# Altium project motordriver-v5.2.PrjPcb (part 2 of 3)

## Sheet ui-jetson-nano.SchDoc
size 420 x 297 mm; SheetNumber: 3; SheetTotal: 13
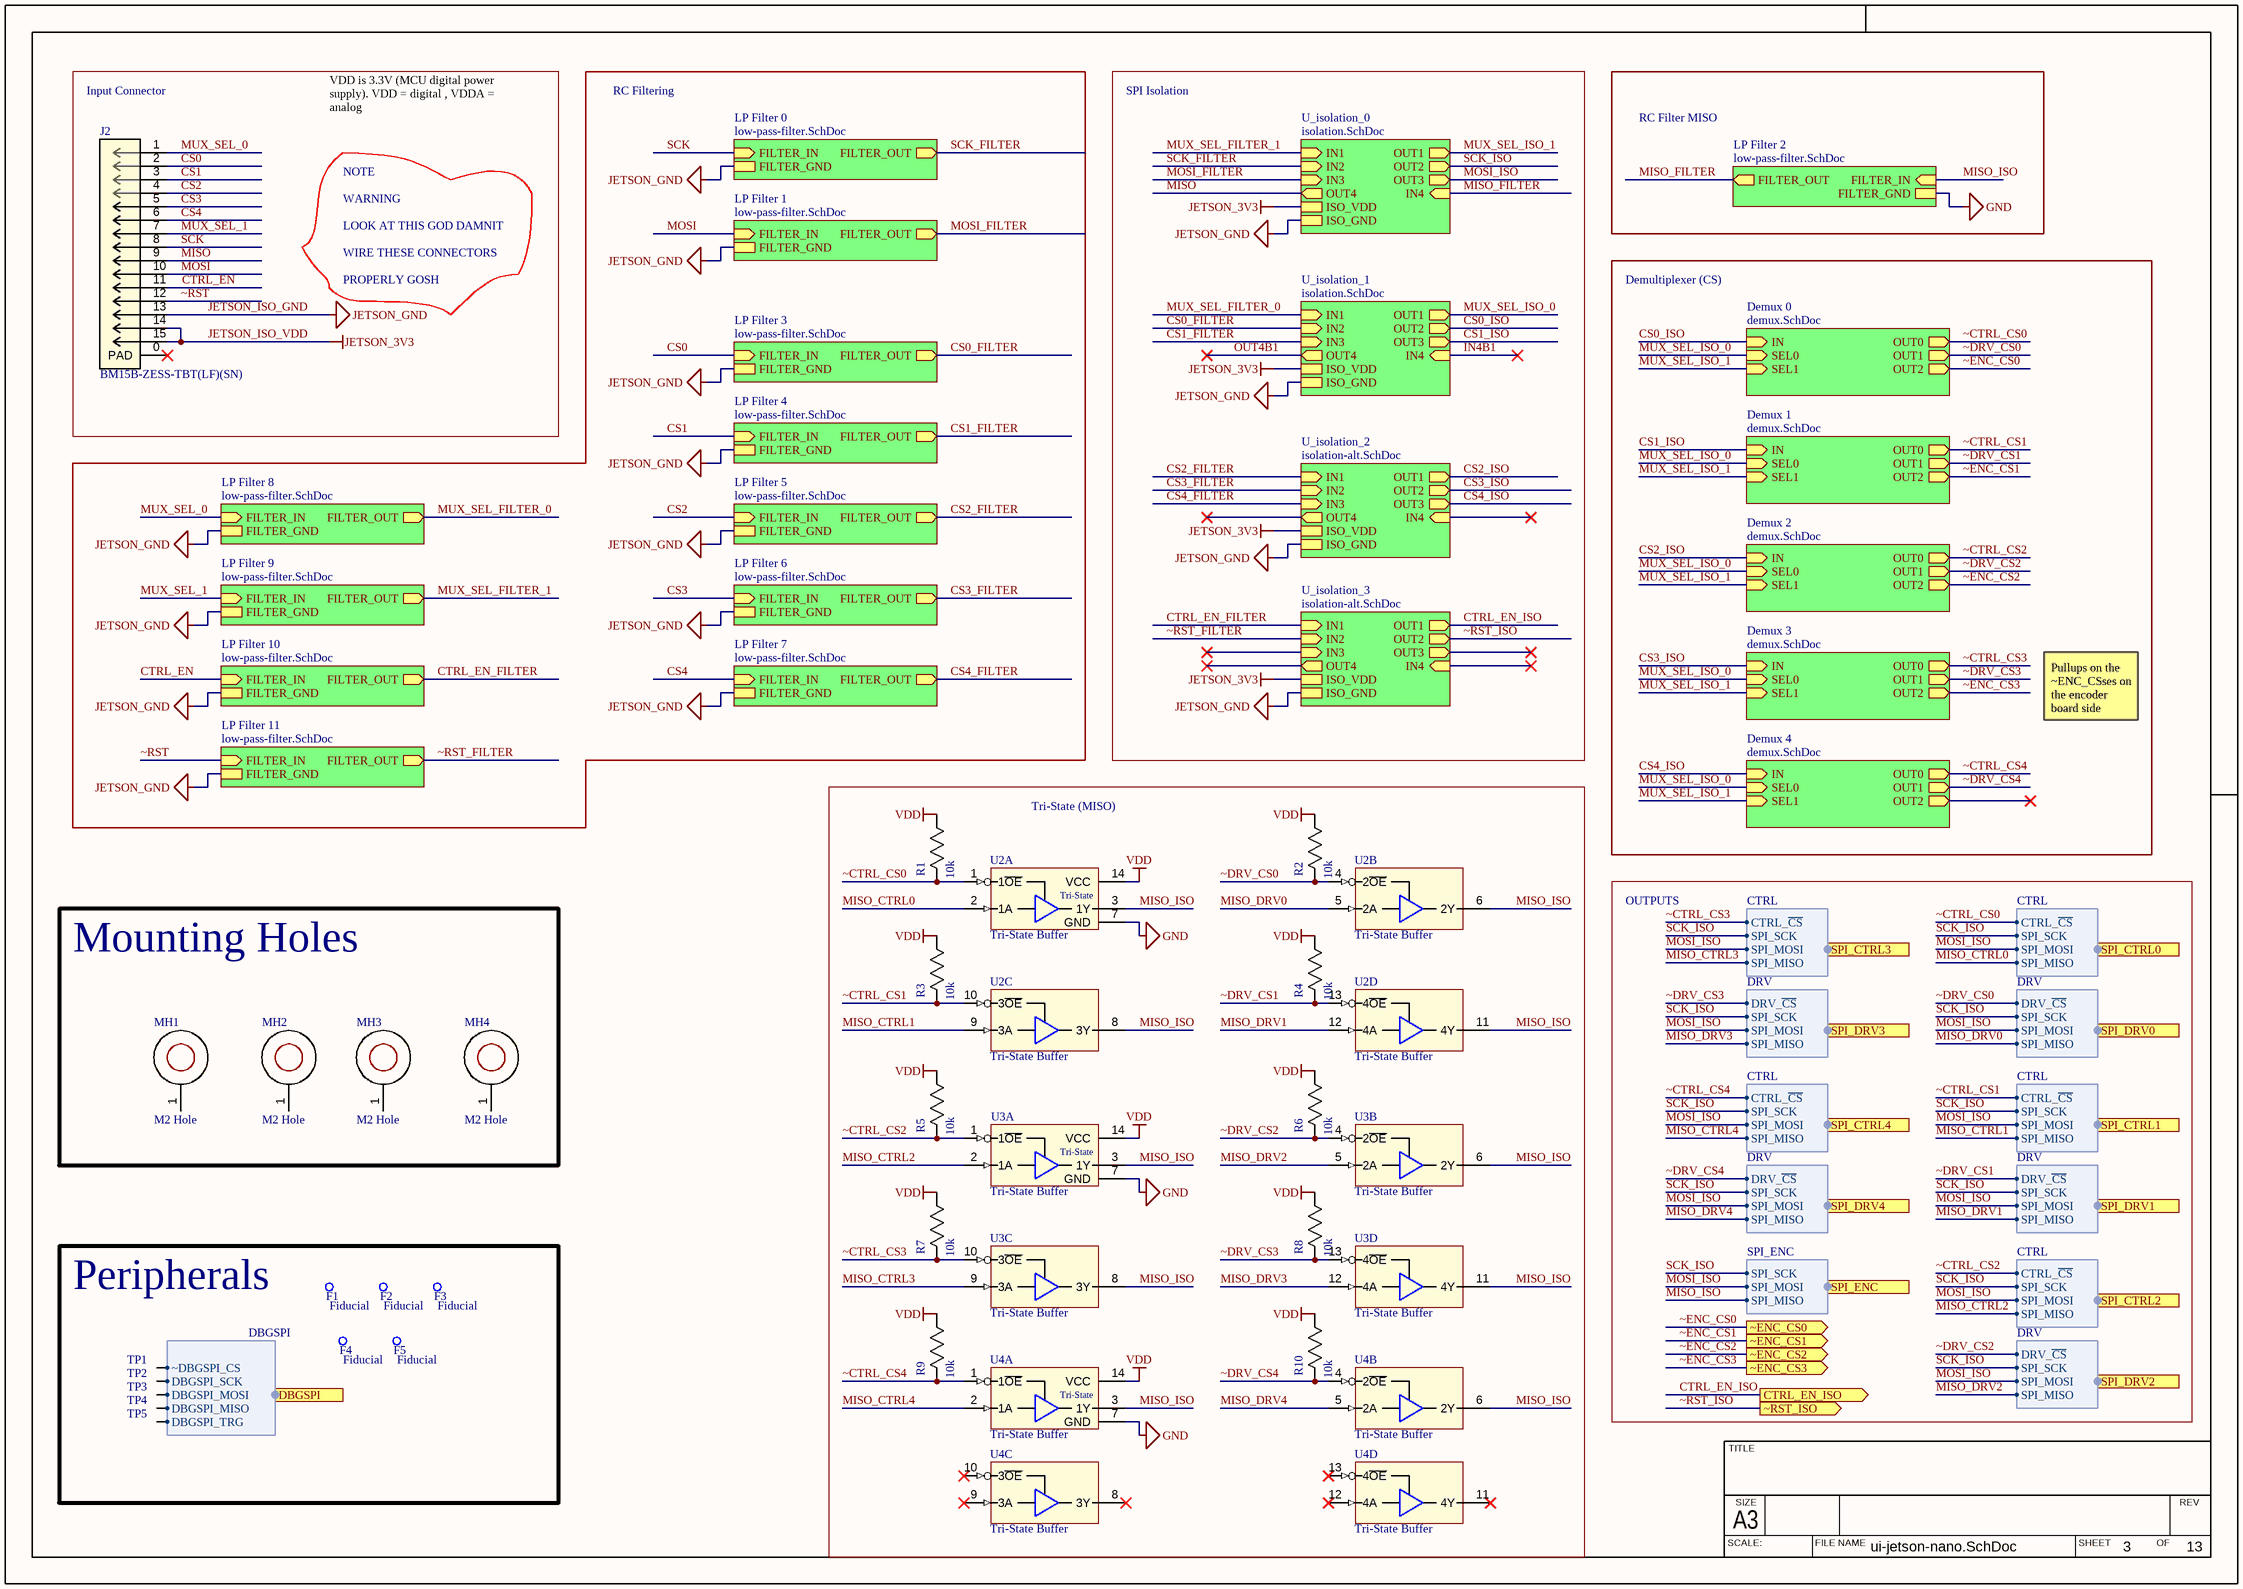
[diagram p6: ui-jetson-nano.SchDoc]

### Parts
F1  Fiducial  [Fiducial]  (no BOM)
F2  Fiducial  [Fiducial]  (no BOM)
F3  Fiducial  [Fiducial]  (no BOM)
F4  Fiducial  [Fiducial]  (no BOM)
F5  Fiducial  [Fiducial]  (no BOM)
J2  BM15B-ZESS-TBT(LF)(SN)  [JST ZE SMT 15POS]
MH1  M2 Hole  [Mounting Hole M2]  (no BOM)
MH2  M2 Hole  [Mounting Hole M2]  (no BOM)
MH3  M2 Hole  [Mounting Hole M2]  (no BOM)
MH4  M2 Hole  [Mounting Hole M2]  (no BOM)
R1  10k  [0603]
R2  10k  [0603]
R3  10k  [0603]
R4  10k  [0603]
R5  10k  [0603]
R6  10k  [0603]
R7  10k  [0603]
R8  10k  [0603]
R9  10k  [0603]
R10  10k  [0603]
TP1  DBG_CS  [TP]  (value not drawn)  (no BOM)
TP2  DBG_SCK  [TP]  (value not drawn)  (no BOM)
TP3  DBG_MOSI  [TP]  (value not drawn)  (no BOM)
TP4  DBG_MISO  [TP]  (value not drawn)  (no BOM)
TP5  DBG_TRG  [TP]  (value not drawn)  (no BOM)
U2  Tri-State Buffer  [14-TSSOP]  (parts A,B,C,D of 4)
U3  Tri-State Buffer  [14-TSSOP]  (parts A,B,C,D of 4)
U4  Tri-State Buffer  [14-TSSOP]  (parts A,B,C,D of 4)

### Blocks framed on the sheet
Tri-State (MISO): R1-R10 U2-U4
Mounting Holes: MH1-MH4
Peripherals: F1-F5 TP1-TP5

### Sub-sheets
Demux 0 = demux.SchDoc: IN (in), SEL0 (in), SEL1 (in), OUT1 (out), OUT2 (out), OUT0 (out)
Demux 1 = demux.SchDoc: IN (in), SEL0 (in), SEL1 (in), OUT1 (out), OUT2 (out), OUT0 (out)
Demux 2 = demux.SchDoc: IN (in), SEL0 (in), SEL1 (in), OUT1 (out), OUT2 (out), OUT0 (out)
Demux 3 = demux.SchDoc: IN (in), SEL0 (in), SEL1 (in), OUT1 (out), OUT2 (out), OUT0 (out)
Demux 4 = demux.SchDoc: IN (in), SEL0 (in), SEL1 (in), OUT1 (out), OUT2 (out), OUT0 (out)
LP Filter 0 = low-pass-filter.SchDoc: FILTER_OUT (out), FILTER_IN (in), FILTER_GND
LP Filter 1 = low-pass-filter.SchDoc: FILTER_OUT (out), FILTER_IN (in), FILTER_GND
LP Filter 2 = low-pass-filter.SchDoc: FILTER_OUT (out), FILTER_IN (in), FILTER_GND
LP Filter 3 = low-pass-filter.SchDoc: FILTER_OUT (out), FILTER_IN (in), FILTER_GND
LP Filter 4 = low-pass-filter.SchDoc: FILTER_OUT (out), FILTER_IN (in), FILTER_GND
LP Filter 5 = low-pass-filter.SchDoc: FILTER_OUT (out), FILTER_IN (in), FILTER_GND
LP Filter 6 = low-pass-filter.SchDoc: FILTER_OUT (out), FILTER_IN (in), FILTER_GND
LP Filter 7 = low-pass-filter.SchDoc: FILTER_OUT (out), FILTER_IN (in), FILTER_GND
LP Filter 8 = low-pass-filter.SchDoc: FILTER_OUT (out), FILTER_IN (in), FILTER_GND
LP Filter 9 = low-pass-filter.SchDoc: FILTER_OUT (out), FILTER_IN (in), FILTER_GND
LP Filter 10 = low-pass-filter.SchDoc: FILTER_OUT (out), FILTER_IN (in), FILTER_GND
LP Filter 11 = low-pass-filter.SchDoc: FILTER_OUT (out), FILTER_IN (in), FILTER_GND
U_isolation_0 = isolation.SchDoc: OUT1 (out), IN1 (in), IN2 (in), IN3 (in), OUT4 (out), OUT3 (out), OUT2 (out), IN4 (in), ISO_VDD, ISO_GND
U_isolation_1 = isolation.SchDoc: OUT1 (out), IN1 (in), IN2 (in), IN3 (in), OUT4 (out), OUT3 (out), OUT2 (out), IN4 (in), ISO_VDD, ISO_GND
U_isolation_2 = isolation-alt.SchDoc: OUT1 (out), IN1 (in), IN2 (in), IN3 (in), OUT4 (out), OUT3 (out), OUT2 (out), IN4 (in), ISO_VDD, ISO_GND
U_isolation_3 = isolation-alt.SchDoc: OUT1 (out), IN1 (in), IN2 (in), IN3 (in), OUT4 (out), OUT3 (out), OUT2 (out), IN4 (in), ISO_VDD, ISO_GND

### Ports
CTRL_EN_ISO (out), DBGSPI (harness DBGSPI), SPI_CTRL0 (harness CTRL), SPI_CTRL1 (harness CTRL), SPI_CTRL2 (harness CTRL), SPI_CTRL3 (harness CTRL), SPI_CTRL4 (harness CTRL), SPI_DRV0 (harness DRV), SPI_DRV1 (harness DRV), SPI_DRV2 (harness DRV), SPI_DRV3 (harness DRV), SPI_DRV4 (harness DRV), SPI_ENC (harness SPI_ENC), ~ENC_CS0 (out), ~ENC_CS1 (out), ~ENC_CS2 (out), ~ENC_CS3 (out), ~RST_ISO (out)

### Harnesses
CTRL: SPI_SCK, SPI_MISO, SPI_MOSI, CTRL_~{CS}
DRV: SPI_SCK, SPI_MISO, SPI_MOSI, DRV_~{CS}
SPI_ENC: SPI_SCK, SPI_MISO, SPI_MOSI
DBGSPI: ~DBGSPI_CS, DBGSPI_SCK, DBGSPI_MOSI, DBGSPI_MISO, DBGSPI_TRG

### Nets
GND: U2.7(GND) U3.7(GND) U4.7(GND) ; sheet LP Filter 2/FILTER_GND
JETSON_3V3: J2.14 J2.15 ; sheet U_isolation_0/ISO_VDD, sheet U_isolation_1/ISO_VDD, sheet U_isolation_2/ISO_VDD, sheet U_isolation_3/ISO_VDD  [also labelled JETSON_ISO_VDD]
JETSON_GND: J2.13 ; sheet LP Filter 0/FILTER_GND, sheet U_isolation_0/ISO_GND, sheet U_isolation_1/ISO_GND, sheet U_isolation_2/ISO_GND, sheet U_isolation_3/ISO_GND, sheet LP Filter 1/FILTER_GND, sheet LP Filter 3/FILTER_GND, sheet LP Filter 4/FILTER_GND, sheet LP Filter 5/FILTER_GND, sheet LP Filter 6/FILTER_GND, sheet LP Filter 7/FILTER_GND, sheet LP Filter 8/FILTER_GND, sheet LP Filter 9/FILTER_GND, sheet LP Filter 10/FILTER_GND, sheet LP Filter 11/FILTER_GND  [also labelled JETSON_ISO_GND]
VDD: R1.1(R1) R2.1(R1) R3.1(R1) R4.1(R1) R5.1(R1) R6.1(R1) R7.1(R1) R8.1(R1) R9.1(R1) R10.1(R1) U2.14(VCC) U3.14(VCC) U4.14(VCC)
CS0: J2.2 ; sheet LP Filter 3/FILTER_IN
CS0_FILTER: sheet U_isolation_1/IN2, sheet LP Filter 3/FILTER_OUT
CS0_ISO: sheet U_isolation_1/OUT2, sheet Demux 0/IN
CS1: J2.3 ; sheet LP Filter 4/FILTER_IN
CS1_FILTER: sheet U_isolation_1/IN3, sheet LP Filter 4/FILTER_OUT
CS1_ISO: sheet U_isolation_1/OUT3, sheet Demux 1/IN
CS2: J2.4 ; sheet LP Filter 5/FILTER_IN
CS2_FILTER: sheet U_isolation_2/IN1, sheet LP Filter 5/FILTER_OUT
CS2_ISO: sheet U_isolation_2/OUT1, sheet Demux 2/IN
CS3: J2.5 ; sheet LP Filter 6/FILTER_IN
CS3_FILTER: sheet U_isolation_2/IN2, sheet LP Filter 6/FILTER_OUT
CS3_ISO: sheet U_isolation_2/OUT2, sheet Demux 3/IN
CS4: J2.6 ; sheet LP Filter 7/FILTER_IN
CS4_FILTER: sheet U_isolation_2/IN3, sheet LP Filter 7/FILTER_OUT
CS4_ISO: sheet U_isolation_2/OUT3, sheet Demux 4/IN
CTRL_EN: J2.11 ; sheet LP Filter 10/FILTER_IN
CTRL_EN_FILTER: sheet U_isolation_3/IN1, sheet LP Filter 10/FILTER_OUT
CTRL_EN_ISO: port CTRL_EN_ISO, sheet U_isolation_3/OUT1
DBGSPI.DBGSPI_MISO: TP4.1 ; port DBGSPI.DBGSPI_MISO
DBGSPI.DBGSPI_MOSI: TP3.1 ; port DBGSPI.DBGSPI_MOSI
DBGSPI.DBGSPI_SCK: TP2.1 ; port DBGSPI.DBGSPI_SCK
DBGSPI.DBGSPI_TRG: TP5.1 ; port DBGSPI.DBGSPI_TRG
DBGSPI.~DBGSPI_CS: TP1.1 ; port DBGSPI.~DBGSPI_CS
MISO: J2.9 ; sheet U_isolation_0/OUT4
MISO_CTRL0: U2.2(1A) ; port SPI_CTRL0.SPI_MISO
MISO_CTRL1: U2.9(3A) ; port SPI_CTRL1.SPI_MISO
MISO_CTRL2: U3.2(1A) ; port SPI_CTRL2.SPI_MISO
MISO_CTRL3: U3.9(3A) ; port SPI_CTRL3.SPI_MISO
MISO_CTRL4: U4.2(1A) ; port SPI_CTRL4.SPI_MISO
MISO_DRV0: U2.5(2A) ; port SPI_DRV0.SPI_MISO
MISO_DRV1: U2.12(4A) ; port SPI_DRV1.SPI_MISO
MISO_DRV2: U3.5(2A) ; port SPI_DRV2.SPI_MISO
MISO_DRV3: U3.12(4A) ; port SPI_DRV3.SPI_MISO
MISO_DRV4: U4.5(2A) ; port SPI_DRV4.SPI_MISO
MISO_FILTER: sheet U_isolation_0/IN4, sheet LP Filter 2/FILTER_OUT
MISO_ISO: U2.3(1Y) U2.6(2Y) U2.8(3Y) U2.11(4Y) U3.3(1Y) U3.6(2Y) U3.8(3Y) U3.11(4Y) U4.3(1Y) U4.6(2Y) ; sheet LP Filter 2/FILTER_IN, port SPI_ENC.SPI_MISO
MOSI: J2.10 ; sheet LP Filter 1/FILTER_IN
MOSI_FILTER: sheet U_isolation_0/IN3, sheet LP Filter 1/FILTER_OUT
MOSI_ISO: sheet U_isolation_0/OUT3, port SPI_CTRL0.SPI_MOSI, port SPI_DRV0.SPI_MOSI, port SPI_ENC.SPI_MOSI, port SPI_CTRL1.SPI_MOSI, port SPI_DRV1.SPI_MOSI, port SPI_CTRL2.SPI_MOSI, port SPI_DRV2.SPI_MOSI, port SPI_CTRL3.SPI_MOSI, port SPI_DRV3.SPI_MOSI, port SPI_CTRL4.SPI_MOSI, port SPI_DRV4.SPI_MOSI
MUX_SEL_0: J2.1 ; sheet LP Filter 8/FILTER_IN
MUX_SEL_1: J2.7 ; sheet LP Filter 9/FILTER_IN
MUX_SEL_FILTER_0: sheet U_isolation_1/IN1, sheet LP Filter 8/FILTER_OUT
MUX_SEL_FILTER_1: sheet U_isolation_0/IN1, sheet LP Filter 9/FILTER_OUT
MUX_SEL_ISO_0: sheet U_isolation_1/OUT1, sheet Demux 0/SEL0, sheet Demux 1/SEL0, sheet Demux 2/SEL0, sheet Demux 3/SEL0, sheet Demux 4/SEL0
MUX_SEL_ISO_1: sheet U_isolation_0/OUT1, sheet Demux 0/SEL1, sheet Demux 1/SEL1, sheet Demux 2/SEL1, sheet Demux 3/SEL1, sheet Demux 4/SEL1
SCK: J2.8 ; sheet LP Filter 0/FILTER_IN
SCK_FILTER: sheet LP Filter 0/FILTER_OUT, sheet U_isolation_0/IN2
SCK_ISO: sheet U_isolation_0/OUT2, port SPI_CTRL0.SPI_SCK, port SPI_DRV0.SPI_SCK, port SPI_ENC.SPI_SCK, port SPI_CTRL1.SPI_SCK, port SPI_DRV1.SPI_SCK, port SPI_CTRL2.SPI_SCK, port SPI_DRV2.SPI_SCK, port SPI_CTRL3.SPI_SCK, port SPI_DRV3.SPI_SCK, port SPI_CTRL4.SPI_SCK, port SPI_DRV4.SPI_SCK
~CTRL_CS0: R1.2(R2) U2.1(1~{OE}) ; sheet Demux 0/OUT0, port SPI_CTRL0.CTRL_~{CS}  [project net CTRL_~{CS}]
~CTRL_CS1: R3.2(R2) U2.10(3~{OE}) ; sheet Demux 1/OUT0, port SPI_CTRL1.CTRL_~{CS}  [project net CTRL_~{CS}]
~CTRL_CS2: R5.2(R2) U3.1(1~{OE}) ; sheet Demux 2/OUT0, port SPI_CTRL2.CTRL_~{CS}  [project net CTRL_~{CS}]
~CTRL_CS3: R7.2(R2) U3.10(3~{OE}) ; sheet Demux 3/OUT0, port SPI_CTRL3.CTRL_~{CS}  [project net CTRL_~{CS}]
~CTRL_CS4: R9.2(R2) U4.1(1~{OE}) ; sheet Demux 4/OUT0, port SPI_CTRL4.CTRL_~{CS}  [project net CTRL_~{CS}E]
~DRV_CS0: R2.2(R2) U2.4(2~{OE}) ; sheet Demux 0/OUT1, port SPI_DRV0.DRV_~{CS}  [project net DRV_~{CS}]
~DRV_CS1: R4.2(R2) U2.13(4~{OE}) ; sheet Demux 1/OUT1, port SPI_DRV1.DRV_~{CS}  [project net DRV_~{CS}]
~DRV_CS2: R6.2(R2) U3.4(2~{OE}) ; sheet Demux 2/OUT1, port SPI_DRV2.DRV_~{CS}  [project net DRV_~{CS}]
~DRV_CS3: R8.2(R2) U3.13(4~{OE}) ; sheet Demux 3/OUT1, port SPI_DRV3.DRV_~{CS}  [project net DRV_~{CS}]
~DRV_CS4: R10.2(R2) U4.4(2~{OE}) ; sheet Demux 4/OUT1, port SPI_DRV4.DRV_~{CS}  [project net DRV_~{CS}]
~ENC_CS0: port ~ENC_CS0, sheet Demux 0/OUT2
~ENC_CS1: port ~ENC_CS1, sheet Demux 1/OUT2
~ENC_CS2: port ~ENC_CS2, sheet Demux 2/OUT2
~ENC_CS3: port ~ENC_CS3, sheet Demux 3/OUT2
~RST: J2.12 ; sheet LP Filter 11/FILTER_IN
~RST_FILTER: sheet U_isolation_3/IN2, sheet LP Filter 11/FILTER_OUT
~RST_ISO: port ~RST_ISO, sheet U_isolation_3/OUT2

Not connected (* = marked no-connect by the designer): J2 0(PAD)*; MH1 1; MH2 1; MH3 1; MH4 1; U4 8(3Y)* 9(3A)* 10(3~{OE})* 11(4Y)* 12(4A)* 13(4~{OE})*

### Notes on the sheet
- Input Connector
- RC Filtering
- SPI Isolation
- RC Filter MISO
- VDD is 3.3V (MCU digital power supply). VDD = digital , VDDA = analog
- NOTE
- WARNING
- LOOK AT THIS GOD DAMNIT
- WIRE THESE CONNECTORS
- PROPERLY GOSH
- Demultiplexer (CS)
- Pullups on the ~ENC_CSses on the encoder board side
- OUTPUTS
- TITLE
- SCALE:
- A3
- SIZE
- FILE NAME
- SHEET
- OF
- REV
- (in symbol SN74LVC125APWR, part A) Tri-State

### Library data of the parts
J2 = CN 15POS JST ZE SMT: CONN HEADER VERT SMD 15POS ZE; Supplier 1: Digi-Key; Supplier Part Number 1: 455-4211-1-ND; Part Number: CN 15POS JST ZE SMT; Supplier URL 1: https://www.digikey.ca/en/products/detail/jst-sales-america-inc/BM15B-ZESS-TBT-LF-SN/1886999?s=N4IgTCBcDaIEIFkCMBWOBaAWgUQMq-QBU5CAKAGQDEBKU3AOWpAF0BfIA; Pin Count: 15; Manufacturer Part Number 1: BM15B-ZESS-TBT(LF)(SN)
MH1-MH4 = MOUNTING HOLE M2: Standard M2 Mounting Hole for M2 Standoff; Part Number: MOUNTING HOLE M2
R1-R10 = RES 10k 1/8W 1%: RES SMD 10K OHM 1% 1/8W 0805; Manufacturer Part Number 1: ERJ-H3GJ103V; Power (Watts): 0.125W; Tolerance: 5%; Package: 0805; Value: 10k; Part Number: RES 10k 1/8W 1%; Supplier 1: Digi-Key; Supplier Part Number 1: 10-ERJ-H3GJ103VCT-ND; Manufacturer Part Number 2: RMCF0805JT10K0; Supplier 2: Digi-Key; Supplier Part Number 2: RMCF0805JT10K0CT-ND; Tolerance 2: 5%; Supplier URL 1: https://www.digikey.ca/en/products/detail/panasonic-electronic-components/ERJ-H3GJ103V/13877876?s=N4IgTCBcDaIIwAYC0BRASgKSQCQMwHENFcA1AYQBUkA5AERAF0BfIA; Supplier URL 2: https://www.digikey.ca/en/products/detail/stackpole-electronics-inc/RMCF0805JT10K0/1757762?s=N4IgTCBcDaIEoFkDCAxADADjQVgFIBUBGNAaTSXxAF0BfIA
TP1-TP5 = Test Point (Via): Part Number: Test Point (Via)
U2-U4 = SN74LVC125APWR: Buffer, Non-Inverting 4 Element 1 Bit per Element 3-State Output 14-TSSOP; Part Number: SN74LVC125APWR; Supplier 1: Digi-Key; Supplier Part Number 1: 296-1222-1-ND; Supplier URL 1: https://www.digikey.ca/en/products/detail/texas-instruments/SN74LVC125APWR/276865; Manufacturer Part Number 1: SN74LVC125APWR
F1-F5 = Fiducial: Part Number: Fiducial

## Sheet low-pass-filter.SchDoc
size A4; SheetNumber: 7; SheetTotal: 13
Used 12 times, as channels UI-JETSON-NANO/LP Filter 0, UI-JETSON-NANO/LP Filter 1, UI-JETSON-NANO/LP Filter 3, UI-JETSON-NANO/LP Filter 4, UI-JETSON-NANO/LP Filter 5, UI-JETSON-NANO/LP Filter 6, UI-JETSON-NANO/LP Filter 7, UI-JETSON-NANO/LP Filter 8, UI-JETSON-NANO/LP Filter 9, UI-JETSON-NANO/LP Filter 10, UI-JETSON-NANO/LP Filter 2, UI-JETSON-NANO/LP Filter 11. Parts and nets are listed once, with the designators drawn on the sheet.
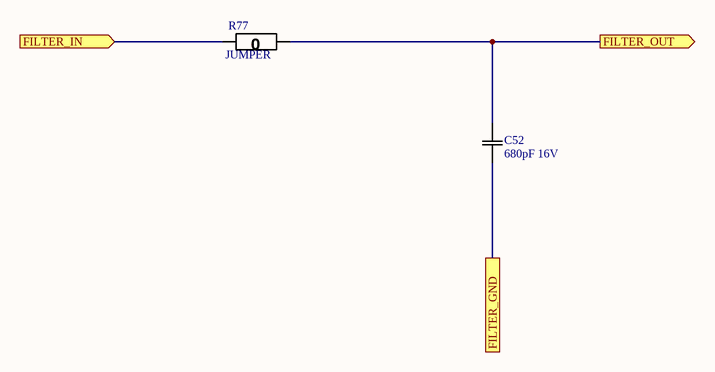
[diagram p7: low-pass-filter.SchDoc]

### Parts
C52  680pF 16V  [0603]
R77  JUMPER  [0603]

### Ports
FILTER_GND, FILTER_IN (in), FILTER_OUT (out)

### Nets
FILTER_GND: C52.1(C1) ; port FILTER_GND
FILTER_IN: R77.2(R2) ; port FILTER_IN
FILTER_OUT: C52.2(C2) R77.1(R1) ; port FILTER_OUT

### Channels
UI-JETSON-NANO/LP Filter 0: designators end in A; ports FILTER_GND=JETSON_GND FILTER_IN=SCK FILTER_OUT=SCK_FILTER
UI-JETSON-NANO/LP Filter 1: designators end in B; ports FILTER_GND=JETSON_GND FILTER_IN=MOSI FILTER_OUT=MOSI_FILTER
UI-JETSON-NANO/LP Filter 3: designators end in C; ports FILTER_GND=JETSON_GND FILTER_IN=CS0 FILTER_OUT=CS0_FILTER
UI-JETSON-NANO/LP Filter 4: designators end in D; ports FILTER_GND=JETSON_GND FILTER_IN=CS1 FILTER_OUT=CS1_FILTER
UI-JETSON-NANO/LP Filter 5: designators end in E; ports FILTER_GND=JETSON_GND FILTER_IN=CS2 FILTER_OUT=CS2_FILTER
UI-JETSON-NANO/LP Filter 6: designators end in F; ports FILTER_GND=JETSON_GND FILTER_IN=CS3 FILTER_OUT=CS3_FILTER
UI-JETSON-NANO/LP Filter 7: designators end in G; ports FILTER_GND=JETSON_GND FILTER_IN=CS4 FILTER_OUT=CS4_FILTER
UI-JETSON-NANO/LP Filter 8: designators end in H; ports FILTER_GND=JETSON_GND FILTER_IN=MUX_SEL_0 FILTER_OUT=MUX_SEL_FILTER_0
UI-JETSON-NANO/LP Filter 9: designators end in I; ports FILTER_GND=JETSON_GND FILTER_IN=MUX_SEL_1 FILTER_OUT=MUX_SEL_FILTER_1
UI-JETSON-NANO/LP Filter 10: designators end in J; ports FILTER_GND=JETSON_GND FILTER_IN=CTRL_EN FILTER_OUT=CTRL_EN_FILTER
UI-JETSON-NANO/LP Filter 2: designators end in K; ports FILTER_GND=GND FILTER_IN=MISO_ISO FILTER_OUT=MISO_FILTER
UI-JETSON-NANO/LP Filter 11: designators end in L; ports FILTER_GND=JETSON_GND FILTER_IN=~RST FILTER_OUT=~RST_FILTER

### Library data of the parts
C52 = CAP 680pF 16V: Default Symbol for Capacitors; Manufacturer Part Number 1: 885012006028; Temperature Coefficient: X5R; Tolerance: 10%; Part Number: CAP 680pF 16V; Value: 680pF; Rating: 16V; Supplier 1: Digi-Key; Supplier Part Number 1: 732-12251-1-ND
R77 = RES 0 JUMPER: RES SMD 0 OHM JUMPER GENERIC 0805; Manufacturer Part Number 1: RK73Z1JTTD; Value: 0; Package: 0805; Part Number: RES 0 JUMPER; Tolerance: N/A; Supplier 1: Digi-Key; Supplier Part Number 1: 2019-RK73Z1JTTDCT-ND; Supplier URL 1: https://www.digikey.ca/en/products/detail/koa-speer-electronics-inc/RK73Z1JTTD/9845478

## Sheet isolation.SchDoc
size A4; SheetNumber: 4; SheetTotal: 13
Used 2 times, as channels UI-JETSON-NANO/U_isolation_0, UI-JETSON-NANO/U_isolation_1. Parts and nets are listed once, with the designators drawn on the sheet.
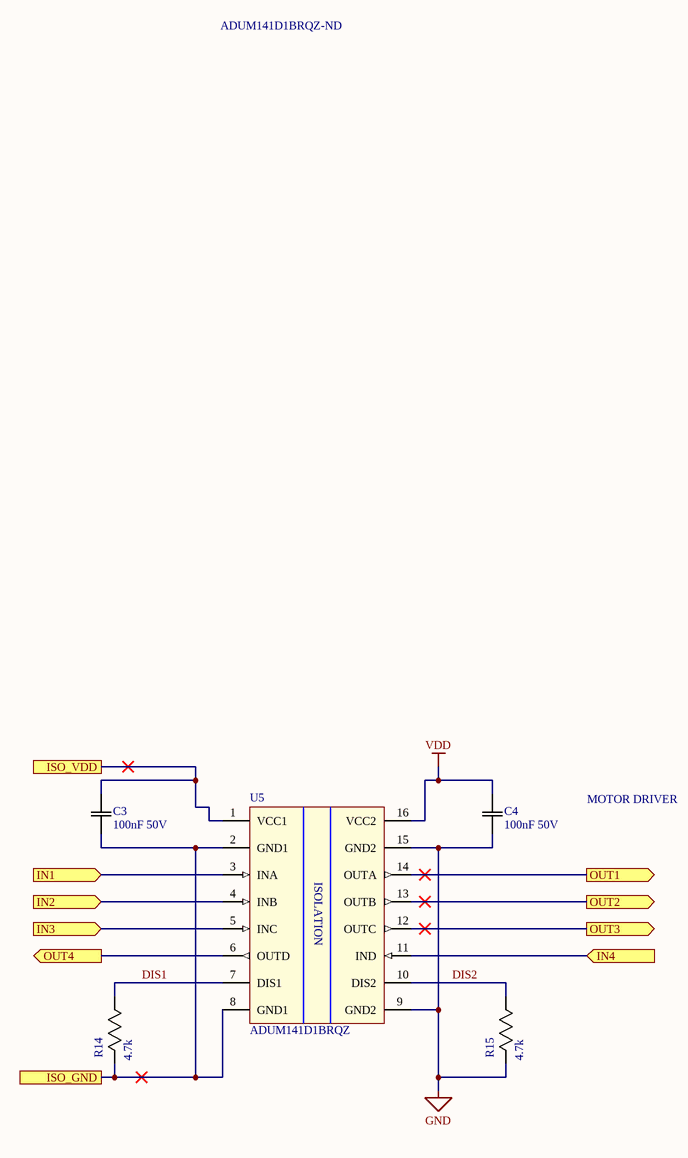
[diagram p8: isolation.SchDoc]

### Parts
C3  100nF 50V  [0603]
C4  100nF 50V  [0603]
R14  4.7k  [0603]
R15  4.7k  [0603]
U5  ADUM141D1BRQZ  Supplier Part Number 1: ADUM141D1BRQZ-ND  [SOP64P600X175-16N]

### Ports
IN1 (in), IN2 (in), IN3 (in), IN4 (in), ISO_GND, ISO_VDD, OUT1 (out), OUT2 (out), OUT3 (out), OUT4 (out)

### Nets
GND: C4.1(C1) R15.2(R2) U5.9(GND2) U5.15(GND2)
VDD: C4.2(C2) U5.16(VCC2)
DIS1: R14.1(R1) U5.7(DIS1)
DIS2: R15.1(R1) U5.10(DIS2)
IN1: U5.3(INA) ; port IN1
IN2: U5.4(INB) ; port IN2
IN3: U5.5(INC) ; port IN3
IN4: U5.11(IND) ; port IN4
ISO_GND: C3.1(C1) R14.2(R2) U5.2(GND1) U5.8(GND1) ; port ISO_GND
ISO_VDD: C3.2(C2) U5.1(VCC1) ; port ISO_VDD
OUT1: U5.14(OUTA) ; port OUT1
OUT2: U5.13(OUTB) ; port OUT2
OUT3: U5.12(OUTC) ; port OUT3
OUT4: U5.6(OUTD) ; port OUT4

### Channels
UI-JETSON-NANO/U_isolation_0: designators end in A; ports IN1=MUX_SEL_FILTER_1 IN2=SCK_FILTER IN3=MOSI_FILTER IN4=MISO_FILTER ISO_GND=JETSON_GND ISO_VDD=JETSON_3V3 OUT1=MUX_SEL_ISO_1 OUT2=SCK_ISO OUT3=MOSI_ISO OUT4=MISO
UI-JETSON-NANO/U_isolation_1: designators end in B; ports IN1=MUX_SEL_FILTER_0 IN2=CS0_FILTER IN3=CS1_FILTER IN4=IN4B1 ISO_GND=JETSON_GND ISO_VDD=JETSON_3V3 OUT1=MUX_SEL_ISO_0 OUT2=CS0_ISO OUT3=CS1_ISO OUT4=OUT4B1

### Notes on the sheet
- MOTOR DRIVER
- (in symbol ISO ADUM141D1BRQZ) ISOLATION

### Library data of the parts
C3 C4 = CAP 100nF 50V: Default Symbol for Capacitors; Manufacturer Part Number 1: CC0603KPX7R9BB104; Temperature Coefficient: X7R; Tolerance: 10%; Part Number: CAP 100nF 50V; Supplier 1: Digi-Key; Supplier Part Number 1: 311-3567-1-ND; Manufacturer Part Number 2: 0805J0500104KJT; Supplier 2: Digi-Key; Supplier Part Number 2: 1608-1458-1-ND; Value: 100nF; Rating: 50V
R14 R15 = RES 4.7k 1/8W - 5%: Default Resistor Symbol; Manufacturer Part Number 1: RMCF0603JT4K70; Power (Watts): 0.125W; Tolerance: 5%; Package: 0805; Value: 4.7k; Part Number: RES 4.7k 1/8W - 5%; Supplier 1: Digi-Key; Supplier Part Number 1: RMCF0603JT4K70CT-ND; Supplier URL 1: https://www.digikey.ca/en/products/detail/stackpole-electronics-inc/RMCF0603JT4K70/1757976
U5 = ISO ADUM141D1BRQZ: Digital Isolator CMOS 4-CH 150Mbps 16-Pin QSOP T/R; Supplier 1: Digi-Key; Part Number: ISO ADUM141D1BRQZ; Supplier URL 1: https://www.digikey.ca/en/products/detail/analog-devices-inc/ADUM141D1BRQZ/7606661; Manufacturer Part Number 1: ADUM141D1BRQZ

## Sheet isolation-alt.SchDoc
size A4; SheetNumber: 5; SheetTotal: 13
Used 2 times, as channels UI-JETSON-NANO/U_isolation_2, UI-JETSON-NANO/U_isolation_3. Parts and nets are listed once, with the designators drawn on the sheet.
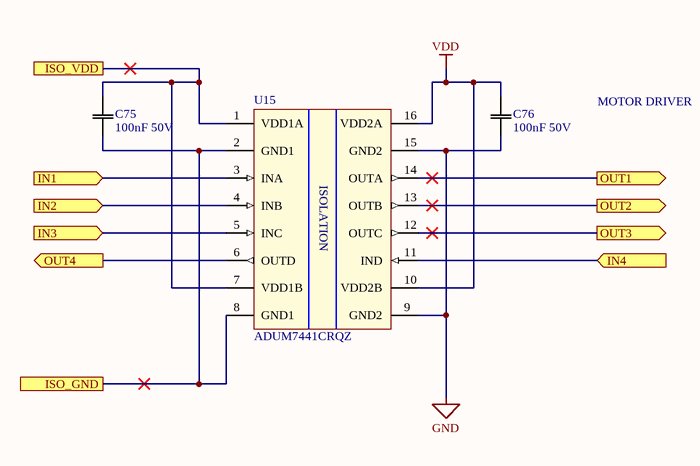
[diagram p9: isolation-alt.SchDoc]

### Parts
C75  100nF 50V  [0603]
C76  100nF 50V  [0603]
U15  ADUM7441CRQZ  [SOP64P600X175-16N]

### Ports
IN1 (in), IN2 (in), IN3 (in), IN4 (in), ISO_GND, ISO_VDD, OUT1 (out), OUT2 (out), OUT3 (out), OUT4 (out)

### Nets
GND: C76.1(C1) U15.9(GND2) U15.15(GND2)
VDD: C76.2(C2) U15.10(VDD2B) U15.16(VDD2A)
IN1: U15.3(INA) ; port IN1
IN2: U15.4(INB) ; port IN2
IN3: U15.5(INC) ; port IN3
IN4: U15.11(IND) ; port IN4
ISO_GND: C75.1(C1) U15.2(GND1) U15.8(GND1) ; port ISO_GND
ISO_VDD: C75.2(C2) U15.1(VDD1A) U15.7(VDD1B) ; port ISO_VDD
OUT1: U15.14(OUTA) ; port OUT1
OUT2: U15.13(OUTB) ; port OUT2
OUT3: U15.12(OUTC) ; port OUT3
OUT4: U15.6(OUTD) ; port OUT4

### Channels
UI-JETSON-NANO/U_isolation_2: designators end in A; ports IN1=CS2_FILTER IN2=CS3_FILTER IN3=CS4_FILTER IN4=IN4_U_isolation_2 ISO_GND=JETSON_GND ISO_VDD=JETSON_3V3 OUT1=CS2_ISO OUT2=CS3_ISO OUT3=CS4_ISO OUT4=OUT4_U_isolation_2
UI-JETSON-NANO/U_isolation_3: designators end in B; ports IN1=CTRL_EN_FILTER IN2=~RST_FILTER IN3=IN3_U_isolation_3 IN4=IN4_U_isolation_3 ISO_GND=JETSON_GND ISO_VDD=JETSON_3V3 OUT1=CTRL_EN_ISO OUT2=~RST_ISO OUT3=OUT3_U_isolation_3 OUT4=OUT4_U_isolation_3

### Notes on the sheet
- MOTOR DRIVER
- (in symbol ISO ADUM7441CRQZ) ISOLATION

### Library data of the parts
C75 C76 = CAP 100nF 50V: as C3 on sheet isolation; Part Number: CAP 100nF 50V; Supplier 1: Digi-Key; Supplier Part Number 1: 311-3567-1-ND; Manufacturer Part Number 2: 0805J0500104KJT; Supplier 2: Digi-Key; Supplier Part Number 2: 1608-1458-1-ND; Value: 100nF; Rating: 50V
U15 = ISO ADUM7441CRQZ: Digital Isolator CMOS 4-CH 150Mbps 16-Pin QSOP T/R; Part Number: ISO ADUM7441CRQZ; Manufacturer Part Number 1: ADUM7441CRQZ; Supplier 1: Digi-Key; Supplier Part Number 1: 505-ADUM7441CRQZ-ND-ND; Supplier URL 1: https://www.digikey.ca/en/products/detail/analog-devices-inc/ADUM7441CRQZ/2237744

## Sheet demux.SchDoc
size A4; SheetNumber: 6; SheetTotal: 13
Used 5 times, as channels UI-JETSON-NANO/Demux 0, UI-JETSON-NANO/Demux 1, UI-JETSON-NANO/Demux 2, UI-JETSON-NANO/Demux 3, UI-JETSON-NANO/Demux 4. Parts and nets are listed once, with the designators drawn on the sheet.
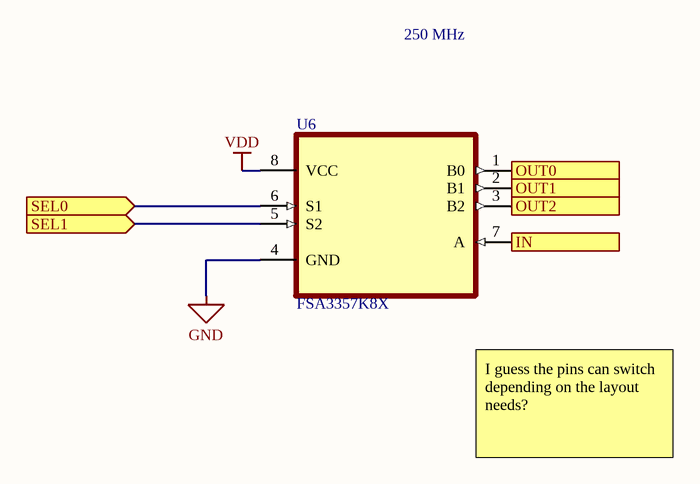
[diagram p10: demux.SchDoc]

### Parts
U6  FSA3357K8X  [SOP50P310X90-8N]

### Ports
IN (in), OUT0 (out), OUT1 (out), OUT2 (out), SEL0 (in), SEL1 (in)

### Nets
GND: U6.4(GND)
VDD: U6.8(VCC)
IN: U6.7(A) ; port IN
OUT0: U6.1(B0) ; port OUT0
OUT1: U6.2(B1) ; port OUT1
OUT2: U6.3(B2) ; port OUT2
SEL0: U6.6(S1) ; port SEL0
SEL1: U6.5(S2) ; port SEL1

### Channels
UI-JETSON-NANO/Demux 0: designators end in A; ports IN=CS0_ISO OUT0=CTRL_~{CS} OUT1=DRV_~{CS} OUT2=~ENC_CS0 SEL0=MUX_SEL_ISO_0 SEL1=MUX_SEL_ISO_1
UI-JETSON-NANO/Demux 1: designators end in B; ports IN=CS1_ISO OUT0=CTRL_~{CS} OUT1=DRV_~{CS} OUT2=~ENC_CS1 SEL0=MUX_SEL_ISO_0 SEL1=MUX_SEL_ISO_1
UI-JETSON-NANO/Demux 2: designators end in C; ports IN=CS2_ISO OUT0=CTRL_~{CS} OUT1=DRV_~{CS} OUT2=~ENC_CS2 SEL0=MUX_SEL_ISO_0 SEL1=MUX_SEL_ISO_1
UI-JETSON-NANO/Demux 3: designators end in D; ports IN=CS3_ISO OUT0=CTRL_~{CS} OUT1=DRV_~{CS} OUT2=~ENC_CS3 SEL0=MUX_SEL_ISO_0 SEL1=MUX_SEL_ISO_1
UI-JETSON-NANO/Demux 4: designators end in E; ports IN=CS4_ISO OUT0=CTRL_~{CS}E OUT1=DRV_~{CS} OUT2=OUT2_Demux 4 SEL0=MUX_SEL_ISO_0 SEL1=MUX_SEL_ISO_1

### Notes on the sheet
- 250 MHz
- I guess the pins can switch depending on the layout needs?

### Library data of the parts
U6 = FSA3357K8X: Analog Switch ICs Multi/Demultiplexer LV 3:1 SP3T; Package: None; Price: None; Value: *; MP: FSA3357K8X; Availability: Unavailable; Part Number: FSA3357K8X; Supplier 1: Mouser; Supplier Part Number 1: 512-FSA3357K8X; Supplier URL 1: https://www.mouser.ca/ProductDetail/onsemi-Fairchild/FSA3357K8X?qs=sGAEpiMZZMtqBmg8fZQA6wYDAhwKfUHh; Manufacturer Part Number 1: FSA3357K8X

## Sheet trinamic-controller-dribbler.SchDoc
size B; SheetNumber: 9; SheetTotal: 13
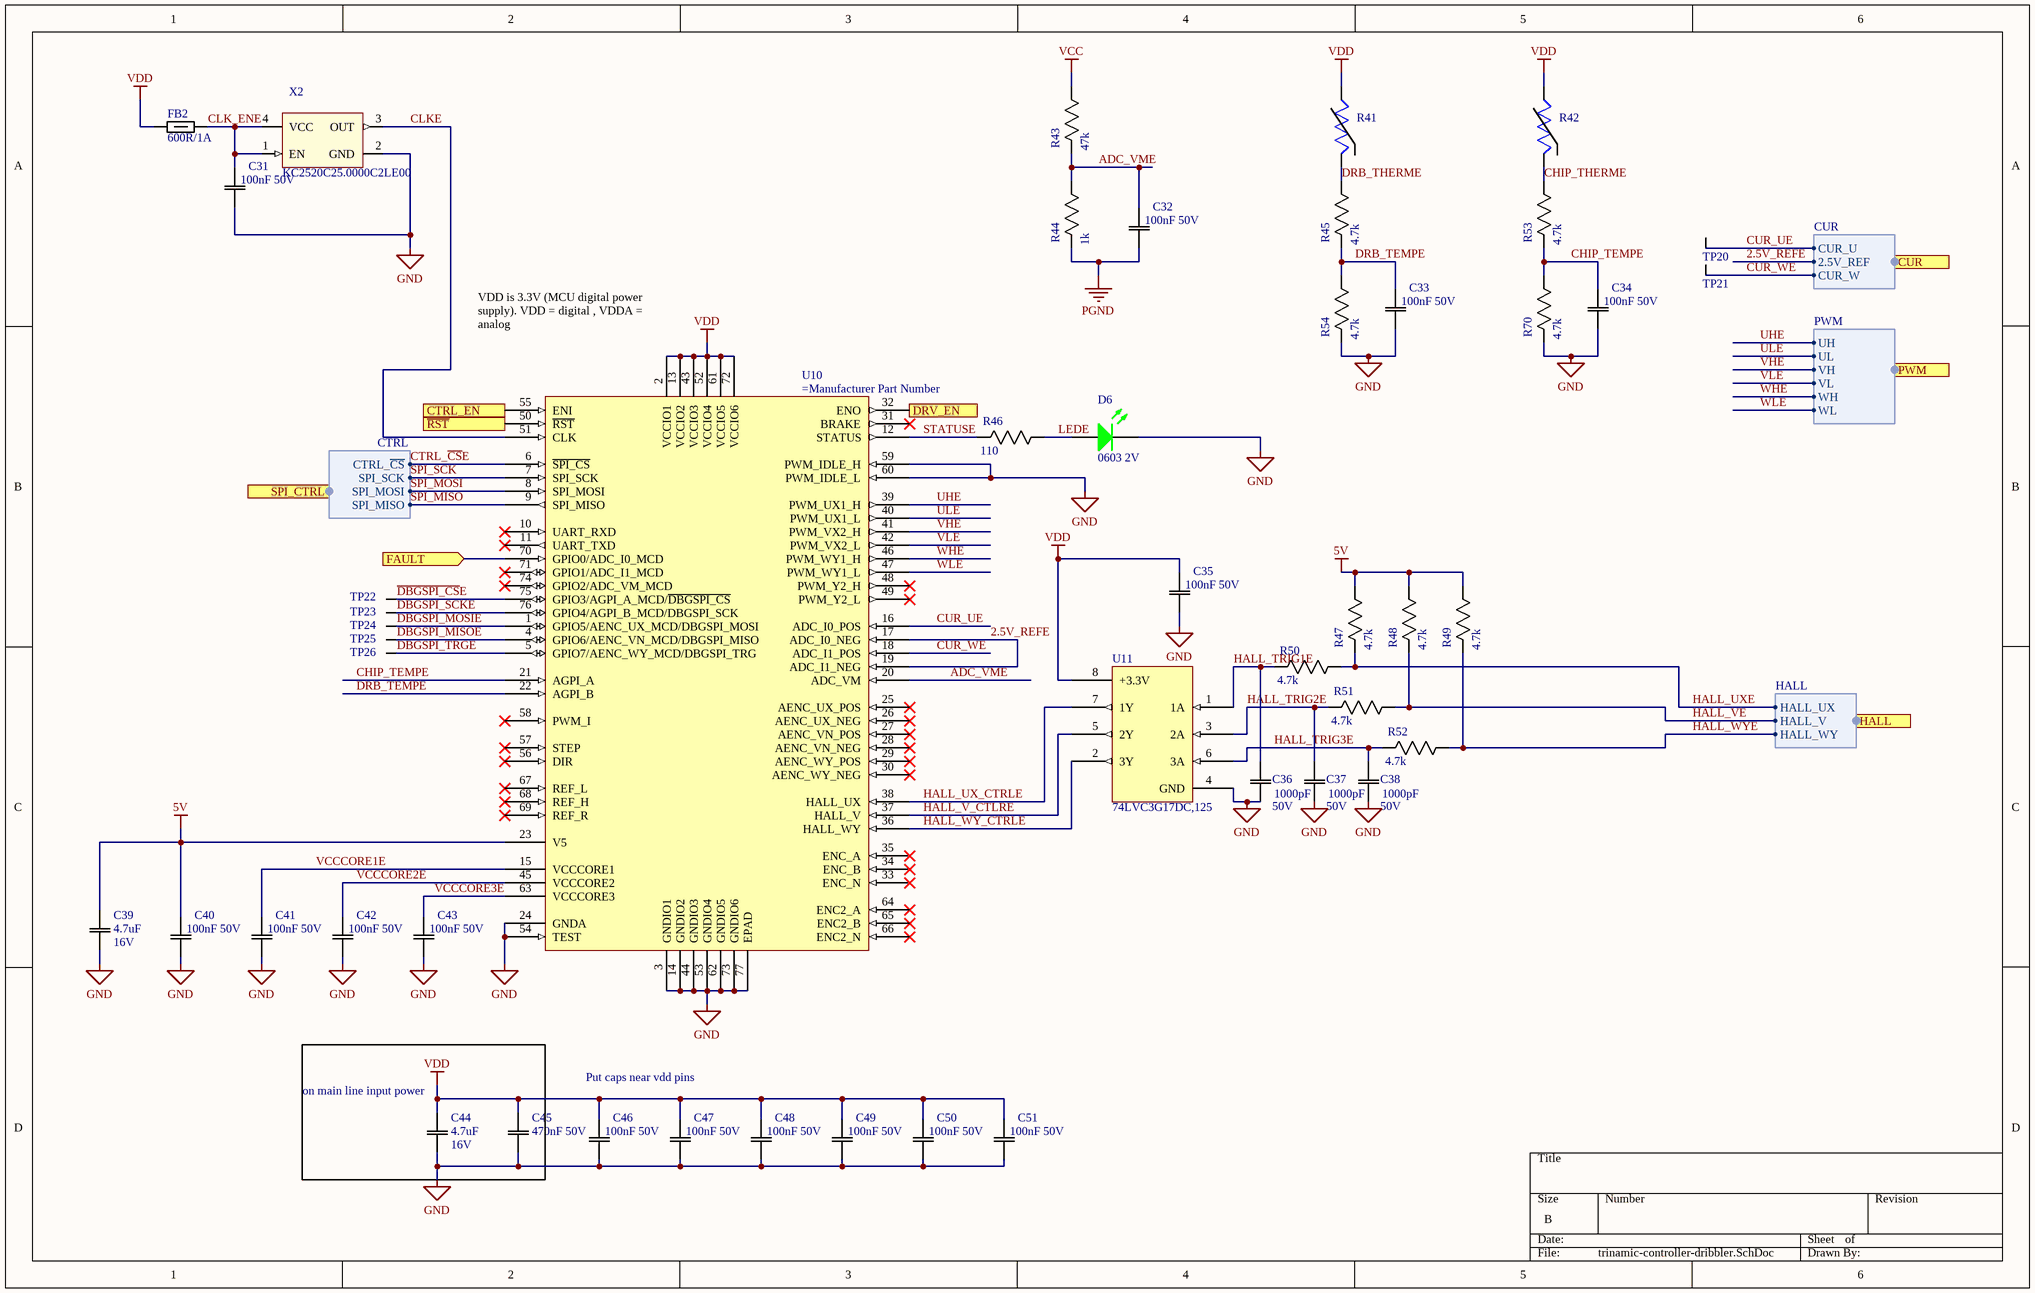
[diagram p11: trinamic-controller-dribbler.SchDoc]

### Parts
C31  100nF 50V  [0603]
C32  100nF 50V  [0603]
C33  100nF 50V  [0603]
C34  100nF 50V  [0603]
C35  100nF 50V  [0603]
C36  value 1000pF  Rating: 50V  [0603]  (hidden comment: 1000pF 50V)
C37  value 1000pF  Rating: 50V  [0603]  (hidden comment: 1000pF 50V)
C38  value 1000pF  Rating: 50V  [0603]  (hidden comment: 1000pF 50V)
C39  value 4.7uF  Rating: 16V  [0603]  (hidden comment: 4.7uF 16V)
C40  100nF 50V  [0603]
C41  100nF 50V  [0603]
C42  100nF 50V  [0603]
C43  100nF 50V  [0603]
C44  value 4.7uF  Rating: 16V  [0603]  (hidden comment: 4.7uF 16V)
C45  470nF 50V  [0603]
C46  100nF 50V  [0603]
C47  100nF 50V  [0603]
C48  100nF 50V  [0603]
C49  100nF 50V  [0603]
C50  100nF 50V  [0603]
C51  100nF 50V  [0603]
D6  0603 2V  [0603 - LED]
FB2  600R/1A  [0603]
R41  RES NTC 10k  [THERMISTOR TH]  (value not drawn)  (no BOM)
R42  RES NTC 10k  [0603]  (value not drawn)
R43  47k  [0603]
R44  1k  [0603]
R45  4.7k  [0603]
R46  110  [0603]
R47  4.7k  [0603]
R48  4.7k  [0603]
R49  4.7k  [0603]
R50  4.7k  [0603]
R51  4.7k  [0603]
R52  4.7k  [0603]
R53  4.7k  [0603]
R54  4.7k  [0603]
R70  4.7k  [0603]
TP20  C_UE  [TP]  (value not drawn)  (no BOM)
TP21  C_WE  [TP]  (value not drawn)  (no BOM)
TP22  DBG_CS  [TP]  (value not drawn)  (no BOM)
TP23  DBG_SCK  [TP]  (value not drawn)  (no BOM)
TP24  DBG_MOSI  [TP]  (value not drawn)  (no BOM)
TP25  DBG_MISO  [TP]  (value not drawn)  (no BOM)
TP26  DBG_TRG  [TP]  (value not drawn)  (no BOM)
U10  (no value)  [QFN40P1050X650X90_HS-77N]
U11  74LVC3G17DC,125  [8-VSSOP]
X2  KC2520C25.0000C2LE00  [KC2520C25.0000C2LE00]

### Blocks framed on the sheet
on main line input power: C44 C45

### Ports
CTRL_EN (in), CUR (harness CUR), DRV_EN (out), FAULT (in), HALL (harness HALL), PWM (harness PWM), SPI_CTRL (harness CTRL), ~{RST} (in)

### Harnesses
PWM: VL, WH, WL, VH, UL, UH
HALL: HALL_UX, HALL_WY, HALL_V
CTRL: SPI_SCK, SPI_MISO, SPI_MOSI, CTRL_~{CS}
CUR: CUR_U, CUR_W, 2.5V_REF

### Nets
5V: C39.2(C2) C40.2(C2) R47.1(R1) R48.1(R1) R49.1(R1) U10.23(V5)
GND: C31.1(C1) C33.1(C1) C34.1(C1) C35.1(C1) C36.1(C1) C37.1(C1) C38.1(C1) C39.1(C1) C40.1(C1) C41.1(C1) C42.1(C1) C43.1(C1) C44.1(C1) C45.1(C1) C46.1(C1) C47.1(C1) C48.1(C1) C49.1(C1) C50.1(C1) C51.1(C1) D6.2(K) R54.2(R2) R70.2(R2) U10.3(GNDIO1) U10.14(GNDIO2) U10.24(GNDA) U10.44(GNDIO3) U10.53(GNDIO4) U10.54(TEST) U10.59(PWM_IDLE_H) U10.60(PWM_IDLE_L) U10.62(GNDIO5) U10.73(GNDIO6) U10.77(EPAD) U11.4(GND) X2.2(GND)
PGND: C32.1(C1) R44.2(R2)
VCC: R43.1(R1)
VDD: C35.2(C2) C44.2(C2) C45.2(C2) C46.2(C2) C47.2(C2) C48.2(C2) C49.2(C2) C50.2(C2) C51.2(C2) FB2.1 R41.2 R42.2 U10.2(VCCIO1) U10.13(VCCIO2) U10.43(VCCIO3) U10.52(VCCIO4) U10.61(VCCIO5) U10.72(VCCIO6) U11.8(+3.3V)
2.5V_REFE: U10.17(ADC_I0_NEG) U10.19(ADC_I1_NEG) ; port CUR.2.5V_REF  [project net 2.5V_REF]
ADC_VME: C32.2(C2) R43.2(R2) R44.1(R1) U10.20(ADC_VM)
CHIP_TEMPE: C34.2(C2) R53.2(R2) R70.1(R1) U10.21(AGPI_A)
CHIP_THERME: R42.1 R53.1(R1)
CLK_ENE: C31.2(C2) FB2.2 X2.1(EN) X2.4(VCC)
CLKE: U10.51(CLK) X2.3(OUT)
CTRL_~{CS}E: U10.6(~{SPI_CS}) ; port SPI_CTRL.CTRL_~{CS}
CTRL_EN_ISO: U10.55(ENI) ; port CTRL_EN
CUR_UE: TP20.1 U10.16(ADC_I0_POS) ; port CUR.CUR_U  [project net CUR_U]
CUR_WE: TP21.1 U10.18(ADC_I1_POS) ; port CUR.CUR_W  [project net CUR_W]
~{DBGSPI_CS}E: TP22.1 U10.75(GPIO3/AGPI_A_MCD/~{DBGSPI_CS})
DBGSPI_MISOE: TP25.1 U10.4(GPIO6/AENC_VN_MCD/DBGSPI_MISO)
DBGSPI_MOSIE: TP24.1 U10.1(GPIO5/AENC_UX_MCD/DBGSPI_MOSI)
DBGSPI_SCKE: TP23.1 U10.76(GPIO4/AGPI_B_MCD/DBGSPI_SCK)
DBGSPI_TRGE: TP26.1 U10.5(GPIO7/AENC_WY_MCD/DBGSPI_TRG)
DRB_TEMPE: C33.2(C2) R45.2(R2) R54.1(R1) U10.22(AGPI_B)
DRB_THERME: R41.1 R45.1(R1)
DRV_EN: U10.32(ENO) ; port DRV_EN
FAULT: U10.70(GPIO0/ADC_I0_MCD) ; port FAULT
HALL_TRIG1E: C36.2(C2) R50.2(R2) U11.1(1A)
HALL_TRIG2E: C37.2(C2) R51.2(R2) U11.3(2A)
HALL_TRIG3E: C38.2(C2) R52.2(R2) U11.6(3A)
HALL_UX_CTRLE: U10.38(HALL_UX) U11.7(1Y)
HALL_UXE: R47.2(R2) R50.1(R1) ; port HALL.HALL_UX
HALL_V_CTLRE: U10.37(HALL_V) U11.5(2Y)
HALL_VE: R48.2(R2) R51.1(R1) ; port HALL.HALL_V
HALL_WY_CTRLE: U10.36(HALL_WY) U11.2(3Y)
HALL_WYE: R49.2(R2) R52.1(R1) ; port HALL.HALL_WY
LEDE: D6.1(A) R46.1(R1)
SPI_MISO: U10.9(SPI_MISO) ; port SPI_CTRL.SPI_MISO  [project net MISO_CTRL4]
SPI_MOSI: U10.8(SPI_MOSI) ; port SPI_CTRL.SPI_MOSI  [project net MOSI_ISO]
SPI_SCK: U10.7(SPI_SCK) ; port SPI_CTRL.SPI_SCK  [project net SCK_ISO]
STATUSE: R46.2(R2) U10.12(STATUS)
UHE: U10.39(PWM_UX1_H) ; port PWM.UH  [project net UH]
ULE: U10.40(PWM_UX1_L) ; port PWM.UL  [project net UL]
VCCCORE1E: C41.2(C2) U10.15(VCCCORE1)
VCCCORE2E: C42.2(C2) U10.45(VCCCORE2)
VCCCORE3E: C43.2(C2) U10.63(VCCCORE3)
VHE: U10.41(PWM_VX2_H) ; port PWM.VH  [project net VH]
VLE: U10.42(PWM_VX2_L) ; port PWM.VL  [project net VL]
WHE: U10.46(PWM_WY1_H) ; port PWM.WH  [project net WH]
WLE: U10.47(PWM_WY1_L) ; port PWM.WL  [project net WL]
~RST_ISO: U10.50(~{RST}) ; port ~{RST}

Not connected (* = marked no-connect by the designer): U10 10(UART_RXD)* 11(UART_TXD)* 25(AENC_UX_POS)* 26(AENC_UX_NEG)* 27(AENC_VN_POS)* 28(AENC_VN_NEG)* 29(AENC_WY_POS)* 30(AENC_WY_NEG)* 31(BRAKE)* 33(ENC_N)* 34(ENC_B)* 35(ENC_A)* 48(PWM_Y2_H)* 49(PWM_Y2_L)* 56(DIR)* 57(STEP)* 58(PWM_I)* 64(ENC2_A)* 65(ENC2_B)* 66(ENC2_N)* 67(REF_L)* 68(REF_H)* 69(REF_R)* 71(GPIO1/ADC_I1_MCD)* 74(GPIO2/ADC_VM_MCD)*

### Notes on the sheet
- (near U10) VDD is 3.3V (MCU digital power supply). VDD = digital , VDDA = analog
- Put caps near vdd pins

### Library data of the parts
C31-C35 C40-C43 C46-C51 = CAP 100nF 50V: Default Symbol for Capacitors; Manufacturer Part Number 1: CC0603KPX7R9BB104; Tolerance: 10%; Temperature Coefficient: X7R; VALUE: 100nF; Rating: 50V; Part Number: CAP 100nF 50V; Supplier 1: Digi-Key; Supplier Part Number 1: 311-3567-1-ND; Manufacturer Part Number 2: 0805J0500104KJT; Supplier 2: Digi-Key; Supplier Part Number 2: 1608-1458-1-ND
C36-C38 = CAP 1000pF 50V: Default Symbol for Capacitors; Manufacturer Part Number 1: 06035C102K4Z2A / 06035C102K4Z2A; Tolerance: 10%; Temperature Coefficient: X7R; Part Number: CAP 1000pF 50V; Supplier 1: Digi-Key; Supplier Part Number 1: 478-6342-1-ND; Manufacturer Part Number 2: 08055C102KAT2A; Supplier 2: Digi-Key; Supplier Part Number 2: 478-1371-1-ND
C39 C44 = CAP 4.7uF 16V: Default Symbol for Capacitors; Manufacturer Part Number 1: C1608X5R1C475K080AE; Tolerance: 10%; Temperature Coefficient: X5R; Part Number: CAP 4.7uF 16V; Supplier 1: Digi-Key; Supplier Part Number 1: 445-175225-1-ND; Manufacturer Part Number 2: C2012X5R1C475K085AB; Supplier 2: Digi-Key; Supplier Part Number 2: 445-14382-1-ND
C45 = CAP 470nF 50V: Default Symbol for Capacitors; Manufacturer Part Number 1: C1608X7R1H474K080AC; Tolerance: 10%; Temperature Coefficient: X7R; VALUE: 470nF; Rating: 50V; Part Number: CAP 470nF 50V; Supplier 1: Digi-Key; Supplier Part Number 1: 445-5952-1-ND; Manufacturer Part Number 2: CL21B474KBFNNNG; Supplier 2: Digi-Key; Supplier Part Number 2: 1276-6482-1-ND
D6 = LED GREEN SMD 0603: LED Uni-Color Green 574nm 2-Pin Chip LED T/R; Manufacturer Part Number 1: LTST-C190KGKT; Current Rating: 20mA; Supplier 1: Digi-Key; Supplier Part Number 1: 160-1435-1-ND; Part Number: LED GREEN SMD 0603; Supplier URL 1: https://www.digikey.ca/en/products/detail/lite-on-inc/LTST-C190KGKT/386815?s=N4IgTCBcDaIIwDYAMBaOAWAzAVjSgcgCIgC6AvkA; Pin Count: 2; Voltage Rating - DC: 2V
FB2 = FERRITE BEAD 200 MOHM 0603 1LN: WURTH ELEKTRONIK - 742792651 - Ferrite Bead, 0603 [1608 Metric], 600 ohm, 1 A, WE-CBF Series, 0.2 ohm, &#177; 25%; VALUE: 600R/1A @ 100 MHz; Supplier 1: Digi-Key; Supplier Part Number 1: 732-1593-1-ND; Part Number: FERRITE BEAD 200 MOHM 0603 1LN; Supplier URL 1: https://www.digikey.ca/en/products/detail/w%C3%BCrth-elektronik/742792651/1638997?s=N4IgTCBcDaIOwGYwFoCMBWAnAtyByAIiALoC%2BQA; Manufacturer Part Number 1: 742792651
R41 = RES NTC 10k TH: Manufacturer Part Number 1: NXRT15XH103FA1B040; Tolerance: 1%; Part Number: RES NTC 10k TH; VALUE: 10k; Supplier 1: Digi-Key; Supplier Part Number 1: 490-7167-ND; Supplier URL 1: https://www.digikey.ca/en/products/detail/murata-electronics/NXRT15XH103FA1B040/3900399?s=N4IgTCBcDaICwE4AMBaA7ARgGxpQOQBEQBdAXyA
R42 = RES NTC 10k CHIP: Manufacturer Part Number 1: NCU18XH103F60RB; Tolerance: 1%; Part Number: RES NTC 10k CHIP; VALUE: 10k; Supplier 1: Digi-Key; Supplier Part Number 1: 490-16279-1-ND; Supplier URL 1: https://www.digikey.ca/en/products/detail/murata-electronics/NCU18XH103F60RB/7363023?s=N4IgTCBcDaICwE4AMBaAjANjAdgelAcgCIgC6AvkA
R43 = RES 47k 1/8W - 1%: Default Resistor Symbol; Manufacturer Part Number 1: MCT06030C4702FP500; Power (Watts): 0.125W; Tolerance: 1%; Package: 0805; VALUE: 47k; Part Number: RES 47k 1/8W - 1%; Supplier 1: Digi-Key; Supplier Part Number 1: MCT0603-47.0K-CFCT-ND; Manufacturer Part Number 2: AC0805FR-0747KL; Supplier 2: Digi-Key; Supplier Part Number 2: YAG3735CT-ND; Tolerance 2: 1%; Supplier URL 1: https://www.digikey.ca/en/products/detail/vishay-beyschlag-draloric-bc-components/MCT06030C4702FP500/2607854?s=N4IgTCBcDaILIGEAqAGAbCgzAWgCwHYA6FAaWwQDFlsA5AERAF0BfIA; Supplier URL 2: https://www.digikey.ca/en/products/detail/yageo/AC0805FR-0747KL/5896858?s=N4IgTCBcDaIJoEEDiBmA7CgrAYQCoFoA5AERAF0BfIA
R44 = RES 1k 1/8W - 1%: Default Resistor Symbol; Manufacturer Part Number 1: MCT06030C1001FP500; Power (Watts): 0.125W; Tolerance: 1%; Package: 0805; VALUE: 1k; Part Number: RES 1k 1/8W - 1%; Supplier 1: Digi-Key; Supplier Part Number 1: MCT0603-1.00K-CFCT-ND; Manufacturer Part Number 2: RMCF0805FT1K00; Supplier 2: Digi-Key; Supplier Part Number 2: RMCF0805FT1K00CT-ND; Tolerance 2: 1%; Supplier URL 1: https://www.digikey.ca/en/products/detail/vishay-beyschlag-draloric-bc-components/MCT06030C1001FP500/2607821?s=N4IgTCBcDaILIGEAqAGAbCgzAWgIwDoUUBpbBAMWWwDkAREAXQF8g; Supplier URL 2: https://www.digikey.ca/en/products/detail/stackpole-electronics-inc/RMCF0805FT1K00/1760090?s=N4IgTCBcDaIEoFkDCAxADADjQVhQFQEYBpNNJPEAXQF8g
R45 R53 R54 R70 = RES 4.7k 1/8W - 1%: Default Resistor Symbol; Manufacturer Part Number 1: RMCF0603FT4K70; Power (Watts): 0.125W; Tolerance: 1%; Package: 0805; VALUE: 4.7k; Part Number: RES 4.7k 1/8W - 1%; Supplier 1: Digi-Key; Supplier Part Number 1: RMCF0603FT4K70CT-ND; Supplier URL 1: https://www.digikey.ca/en/products/detail/stackpole-electronics-inc/RMCF0603FT4K70/1760998
R46 = RES 110.0 1/8W - 1%: Default Resistor Symbol; Manufacturer Part Number 1: RMCF0603FT110R; Power (Watts): 0.125W; Tolerance: 1%; Package: 0805; Value: 110; Part Number: RES 110.0 1/8W - 1%; Supplier 1: Digi-Key; Supplier Part Number 1: RMCF0603FT110RCT-ND; Supplier URL 1: https://www.digikey.ca/en/products/detail/stackpole-electronics-inc/RMCF0603FT110R/1761268
R47-R52 = RES 4.7k 1/8W - 5%: as R14 on sheet isolation; Package: 0805; VALUE: 4.7k; Part Number: RES 4.7k 1/8W - 5%; Supplier 1: Digi-Key; Supplier Part Number 1: RMCF0603JT4K70CT-ND; Supplier URL 1: https://www.digikey.ca/en/products/detail/stackpole-electronics-inc/RMCF0603JT4K70/1757976
TP20-TP26 = Test Point (Via): Part Number: Test Point (Via)
U10 = TMC4671: Motor Driver, -40 To 125Deg C Rohs Compliant: Yes; Manufacturer Part Number 1: TMC4671-LA; Supplier 1: Digi-Key; Supplier Part Number 1: 1460-TMC4671-LA-ND; Part Number: TMC4671; Supplier URL 1: https://www.digikey.ca/en/products/detail/trinamic-motion-control-gmbh/TMC4671-LA/12174669?s=N4IgTCBcDaIIwBYBsAGAtAFQLIGFkHY40AZAQTQDkAREAXQF8g
U11 = IC 74LVC3G17DC,125: IC BUFFER TRIPLE SCHMITT TRIGGER 5.5V VSSOP-8; Supplier 1: Newark; Supplier Part Number 1: 33AC1281; Part Number: IC 74LVC3G17DC,125; Supplier URL 1: https://canada.newark.com/nexperia/74lvc3g17dc-125/buffer-non-inverting-triple-vssop/dp/33AC1281?ost=33ac1281; Manufacturer Part Number 1: 74LVC3G17DC,125
X2 = XTAL OSC 25MHz 3.3V: Oscillator XO 25MHz ±15ppm 15pF CMOS 55% 2.5V/3.3V 4-Pin Mini-CSMD T/R; Frequency: 32.768kHz; Load Capacitance: 12.5pF; Supplier 1: Digi-Key; Supplier Part Number 1: 1253-1254-6-ND; Part Number: XTAL OSC 25MHz 3.3V; Supplier URL 1: https://www.digikey.ca/en/products/detail/kyocera-avx/KC2520C25-0000C2LE00/4867084?s=N4IgTCBcDaIIxgKwGYC0DEBZUDZUDkAREAXQF8g; Manufacturer Part Number 1: KC2520C25.0000C2LE00

## Sheet connectors-dribbler.SchDoc
size A4; SheetNumber: 12; SheetTotal: 13
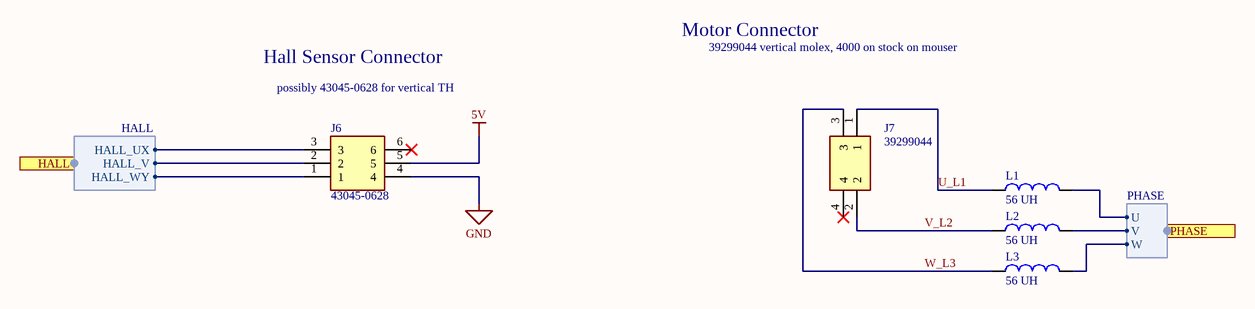
[diagram p12: connectors-dribbler.SchDoc]

### Parts
J6  43045-0628  [430450628]
J7  39299044  [39299044]
L1  56 UH  [EATON _HCM1A1307V2-560-R]
L2  56 UH  [EATON _HCM1A1307V2-560-R]
L3  56 UH  [EATON _HCM1A1307V2-560-R]

### Ports
HALL (harness HALL), PHASE (harness PHASE)

### Harnesses
HALL: HALL_UX, HALL_WY, HALL_V
PHASE: U, V, W

### Nets
5V: J6.5
GND: J6.4
HALL_UXE: J6.3 ; port HALL.HALL_UX
HALL_VE: J6.2 ; port HALL.HALL_V
HALL_WYE: J6.1 ; port HALL.HALL_WY
U: L1.2 ; port PHASE.U
U_L1: J7.1 L1.1
V: L2.2 ; port PHASE.V
V_L2: J7.2 L2.1
W: L3.2 ; port PHASE.W
W_L3: J7.3 L3.1

Not connected (* = marked no-connect by the designer): J6 6*; J7 4*

### Notes on the sheet
- Hall Sensor Connector
- possibly 43045-0628 for vertical TH
- Motor Connector
- 39299044 vertical molex, 4000 on stock on mouser

### Library data of the parts
J6 = CN HDR 6POS Molex 43045-0628: Molex 43045-0628 6POS Microfit / dual row, Vertical; Supplier 1: Digi-Key; Supplier Part Number 1: WM10679-ND; Part Number: CN HDR 6POS Molex 43045-0628; Supplier URL 1: https://www.digikey.ca/en/products/detail/molex/0430450628/3310200?s=N4IgTCBcDaICwGYAMcCsSBsYAcAdXIAugL5A; Pin Count: 6; Manufacturer Part Number 1: 430450628
J7 = CN HDR 4POS Molex 39299044 VERT: Molex 39299044 4POS Minifit / dual row, vertical; Supplier 1: Digi-Key; Supplier Part Number 1: WM7336-ND; Part Number: CN HDR 4POS Molex 39299044 VERT; Supplier URL 1: https://www.digikey.ca/en/products/detail/molex/0039299044/1624292?s=N4IgTCBcDaIOoFkDsBmFA2AtAOQCIgF0BfIA; Pin Count: 4; Manufacturer Part Number 1: 39299044
L1-L3 = IND 56UH 4A 65 mOHM SMD: FIXED IND 56UH 4A 65 MOHM SMD Shielded - Inductor 65mOhm Max Nonstandard -; Value: 56 uH; Current Rating: 4A; Supplier 1: Digi-Key; Supplier Part Number 1: 283-HCM1A1307V2-560-RCT-ND; Part Number: IND 56UH 4A 65 mOHM SMD